# Altium schematic sheet Fastino_References.SchDoc: Fastino
size 420 x 297 mm; Author: G.Kasprowicz; CompanyName: WUT ISE; DrawnBy: G.Kasprowicz; Organization: WUT ISE; Address1: PW ISE; Address2: Nowowiejska 15/19 00-665 Warsaw; Address3: gkasprow@gmail.com; DocumentNumber: 9; Revision: 2; SheetNumber: 10; SheetTotal: 11; ModifiedBy: -; CheckedDate: -; Title2: DAC references; DivGrp: WUT ISE; Designer: G.Kasprowicz; ModifiedDate: -; ProjectName: Sensor Box
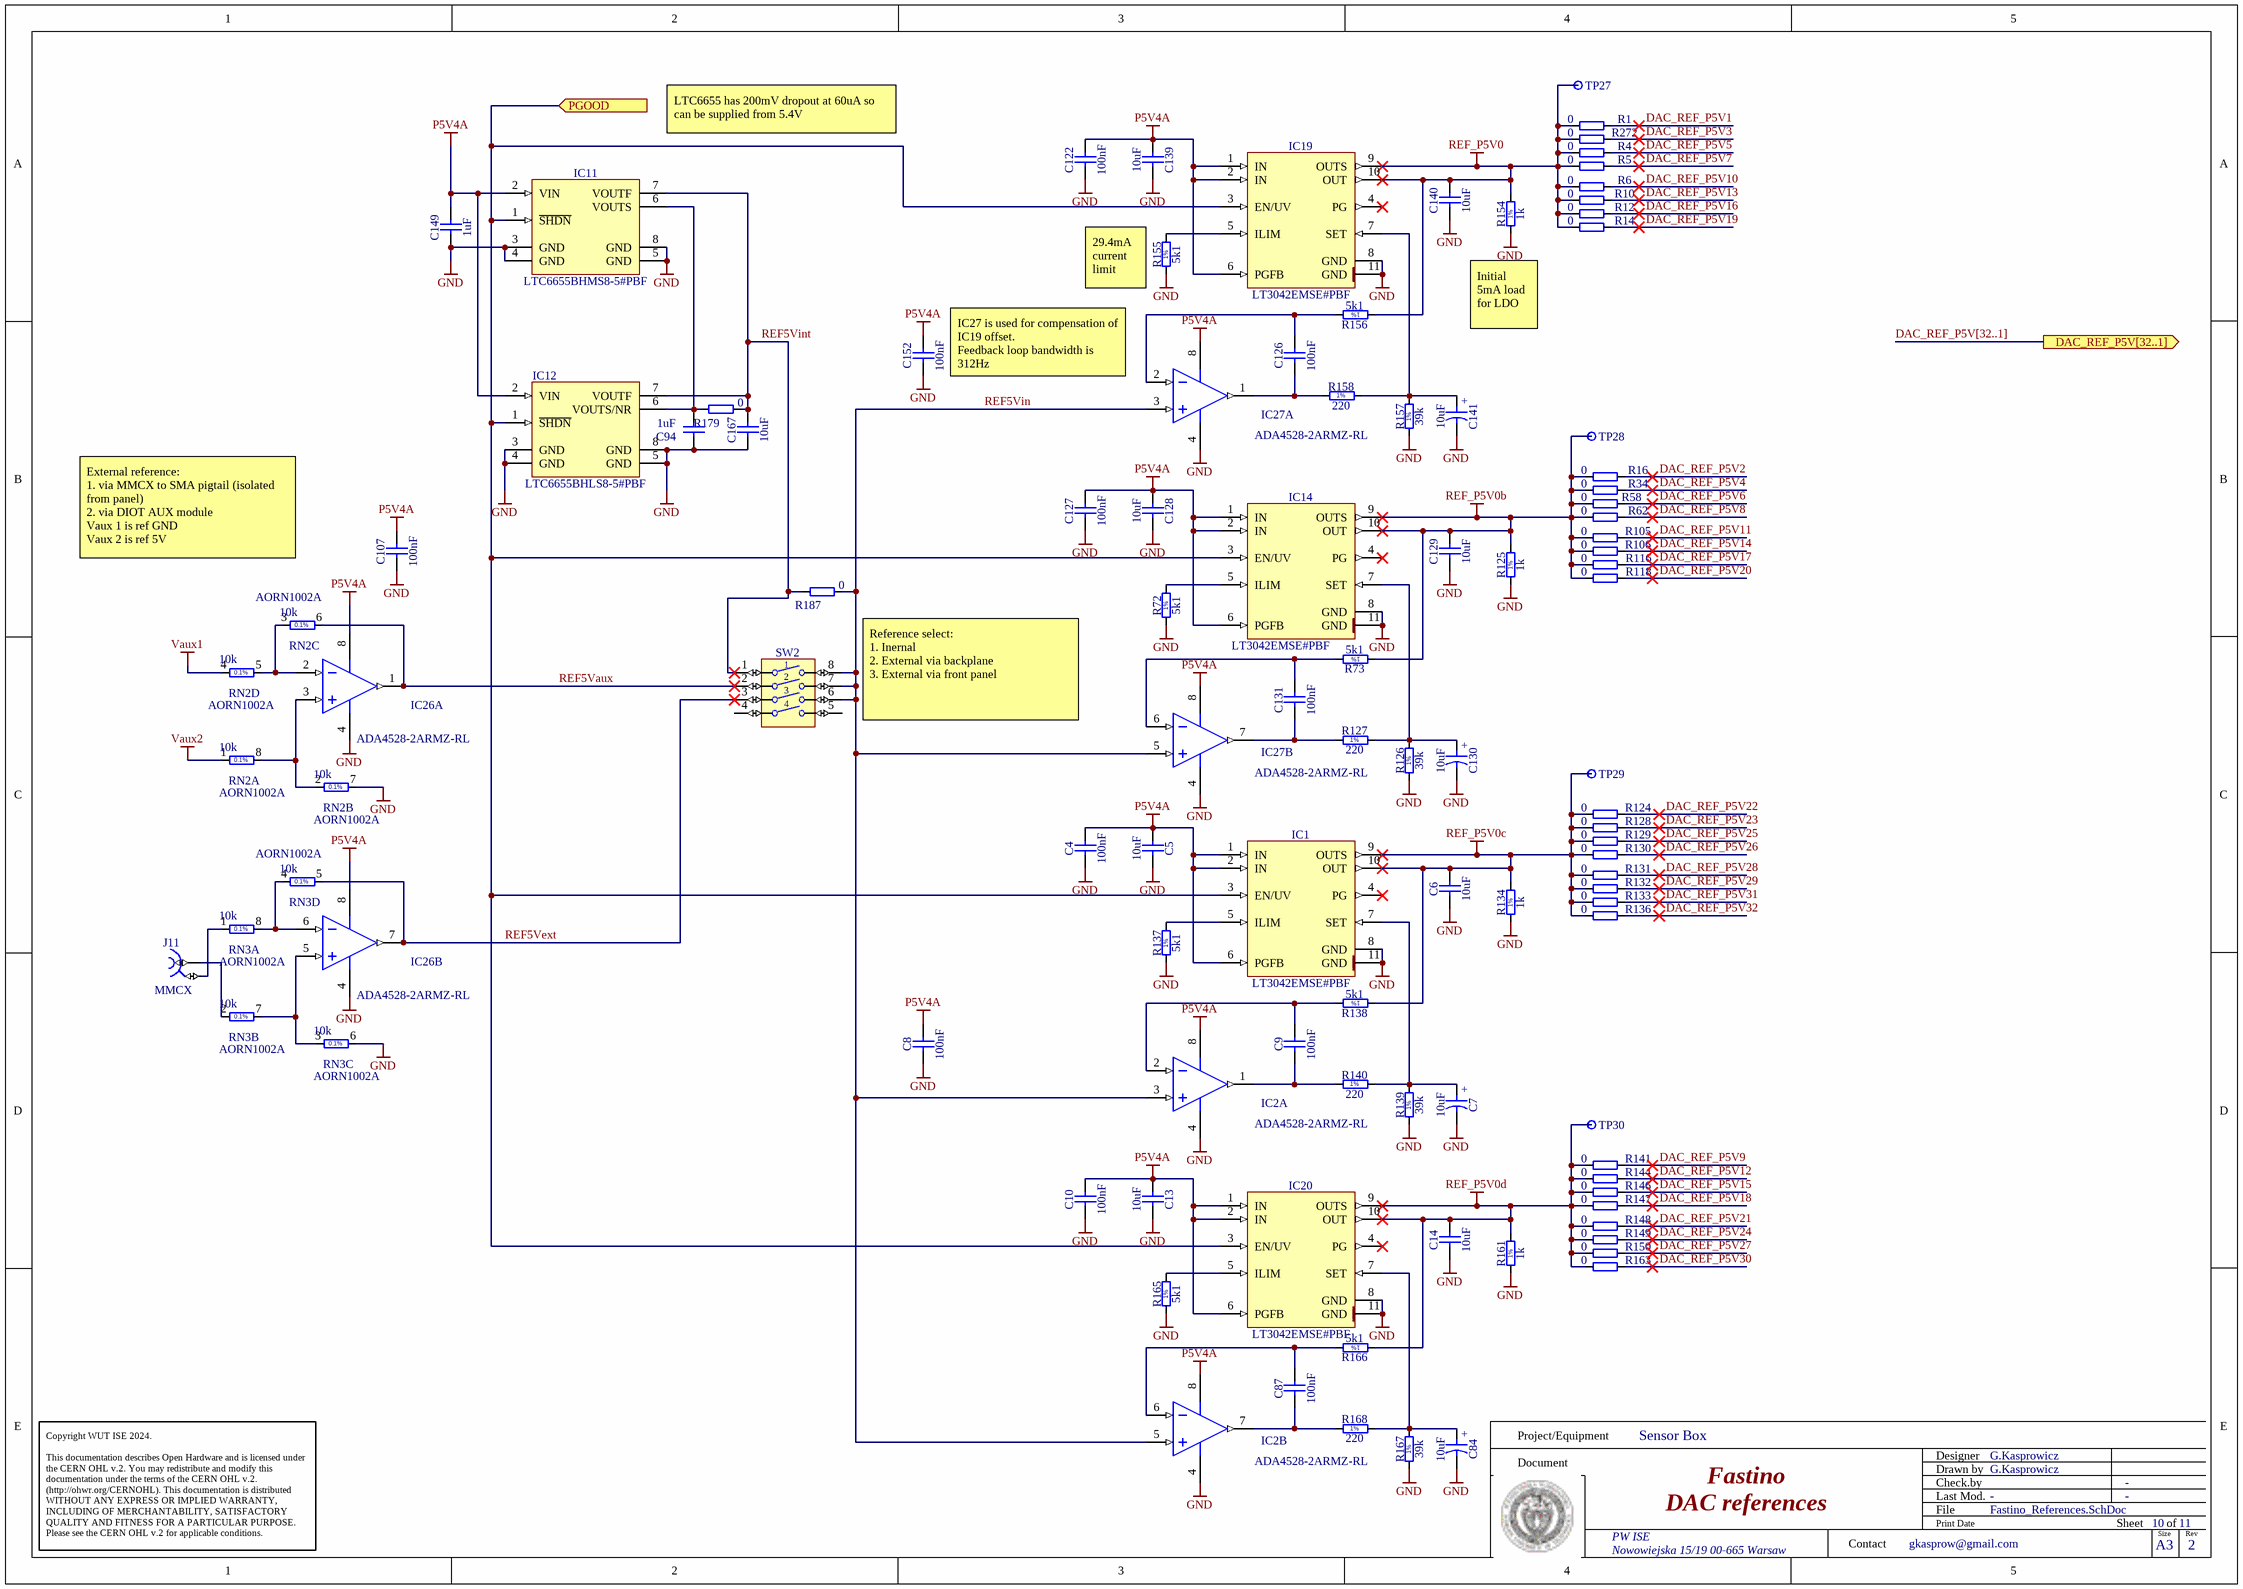
[diagram p0: Fastino_References.SchDoc]

## Parts
C4  100nF  [CAPC1005X55N]
C5  10uF  [CAPC1608X80N]
C6  10uF  [CAPC1608X80N]
C7  10uF  [CAPMP3216X180N]
C8  100nF  [CAPC1005X55N]
C9  100nF  [CAPC1005X55N]
C10  100nF  [CAPC1005X55N]
C13  10uF  [CAPC1608X80N]
C14  10uF  [CAPC1608X80N]
C84  10uF  [CAPMP3216X180N]
C87  100nF  [CAPC1005X55N]
C94  1uF  [CAPC1608X87N]
C107  100nF  [CAPC1005X55N]
C122  100nF  [CAPC1005X55N]
C126  100nF  [CAPC1005X55N]
C127  100nF  [CAPC1005X55N]
C128  10uF  [CAPC1608X80N]
C129  10uF  [CAPC1608X80N]
C130  10uF  [CAPMP3216X180N]
C131  100nF  [CAPC1005X55N]
C139  10uF  [CAPC1608X80N]
C140  10uF  [CAPC1608X80N]
C141  10uF  [CAPMP3216X180N]
C149  1uF  [CAPC1608X87N]
C152  100nF  [CAPC1005X55N]
C167  10uF  [CAPC1608X80N]
IC1  LT3042EMSE#PBF  [SOP50P490X110-11N-R168X198]
IC2  ADA4528-2ARMZ-RL  [ADI-RM-8_N]  (parts A,B of 2)
IC11  LTC6655BHMS8-5#PBF  [SOP65P490X110-8N]
IC12  LTC6655BHLS8-5#PBF  [8-CLCC]
IC14  LT3042EMSE#PBF  [SOP50P490X110-11N-R168X198]
IC19  LT3042EMSE#PBF  [SOP50P490X110-11N-R168X198]
IC20  LT3042EMSE#PBF  [SOP50P490X110-11N-R168X198]
IC26  ADA4528-2ARMZ-RL  [ADI-RM-8_N]  (parts A,B of 2)
IC27  ADA4528-2ARMZ-RL  [ADI-RM-8_N]  (parts A,B of 2)
J11  MMCX  [SAMTEC_MMCX-J-P-H-ST-TH1]
R1  0  [RESC1005X40N]
R4  0  [RESC1005X40N]
R5  0  [RESC1005X40N]
R6  0  [RESC1005X40N]
R10  0  [RESC1005X40N]
R12  0  [RESC1005X40N]
R14  0  [RESC1005X40N]
R16  0  [RESC1005X40N]
R34  0  [RESC1005X40N]
R58  0  [RESC1005X40N]
R62  0  [RESC1005X40N]
R72  5k1  [RESC1005X40N]
R73  5k1  [RESC1005X40N]
R105  0  [RESC1005X40N]
R106  0  [RESC1005X40N]
R116  0  [RESC1005X40N]
R118  0  [RESC1005X40N]
R124  0  [RESC1005X40N]
R125  1k  [RESC1005X40N]
R126  39k  [RESC1608X55N]
R127  220  [RESC1005X40N]
R128  0  [RESC1005X40N]
R129  0  [RESC1005X40N]
R130  0  [RESC1005X40N]
R131  0  [RESC1005X40N]
R132  0  [RESC1005X40N]
R133  0  [RESC1005X40N]
R134  1k  [RESC1005X40N]
R136  0  [RESC1005X40N]
R137  5k1  [RESC1005X40N]
R138  5k1  [RESC1005X40N]
R139  39k  [RESC1608X55N]
R140  220  [RESC1005X40N]
R141  0  [RESC1005X40N]
R144  0  [RESC1005X40N]
R146  0  [RESC1005X40N]
R147  0  [RESC1005X40N]
R148  0  [RESC1005X40N]
R149  0  [RESC1005X40N]
R150  0  [RESC1005X40N]
R154  1k  [RESC1005X40N]
R155  5k1  [RESC1005X40N]
R156  5k1  [RESC1005X40N]
R157  39k  [RESC1608X55N]
R158  220  [RESC1005X40N]
R161  1k  [RESC1005X40N]
R163  0  [RESC1005X40N]
R165  5k1  [RESC1005X40N]
R166  5k1  [RESC1005X40N]
R167  39k  [RESC1608X55N]
R168  220  [RESC1005X40N]
R179  0  [RESC1005X40N]
R187  0  [RESC1005X40N]
R272  0  [RESC1005X40N]
RN2  Manufacturer Part Number: AORN1002A  [SOIC127P600X175-8N]  (hidden comment: 10k)  (parts A,B,C,D of 4)
RN3  Manufacturer Part Number: AORN1002A  [SOIC127P600X175-8N]  (hidden comment: 10k)  (parts A,B,C,D of 4)
SW2  Switch  [SW_TYCO_1571983-4]  (value not drawn)
TP27  Test Point  [TPS127]  (value not drawn)
TP28  Test Point  [TPS127]  (value not drawn)
TP29  Test Point  [TPS127]  (value not drawn)
TP30  Test Point  [TPS127]  (value not drawn)

## Ports
DAC_REF_P5V[32..1] (out), PGOOD (in)

## Nets
GND: C4.1 C5.2 C6.1 C7.2 C8.1 C10.1 C13.2 C14.1 C84.2 C94.1 C107.1 C122.1 C127.1 C128.2 C129.1 C130.2 C139.2 C140.1 C141.2 C149.1 C152.1 C167.1 IC1.8(GND) IC1.11(GND) IC2.4(-V) IC11.3(GND) IC11.4(GND) IC11.5(GND) IC11.8(GND) IC12.3(GND) IC12.4(GND) IC12.5(GND) IC12.8(GND) IC14.8(GND) IC14.11(GND) IC19.8(GND) IC19.11(GND) IC20.8(GND) IC20.11(GND) IC26.4(-V) IC27.4(-V) R72.1 R125.1 R126.1 R134.1 R137.1 R139.1 R154.1 R155.1 R157.1 R161.1 R165.1 R167.1 RN2.7 RN3.6
P5V4A: C4.2 C5.1 C8.2 C10.2 C13.1 C107.2 C122.2 C127.2 C128.1 C139.1 C149.2 C152.2 IC1.1(IN) IC1.2(IN) IC1.6(PGFB) IC2.8(+V) IC11.2(VIN) IC12.2(VIN) IC14.1(IN) IC14.2(IN) IC14.6(PGFB) IC19.1(IN) IC19.2(IN) IC19.6(PGFB) IC20.1(IN) IC20.2(IN) IC20.6(PGFB) IC26.8(+V) IC27.8(+V)
REF_P5V0: C140.2 IC19.9(OUTS) IC19.10(OUT) R1.1 R4.1 R5.1 R6.1 R10.1 R12.1 R14.1 R154.2 R156.1 R272.1 TP27.1
REF_P5V0b: C129.2 IC14.9(OUTS) IC14.10(OUT) R16.1 R34.1 R58.1 R62.1 R73.1 R105.1 R106.1 R116.1 R118.1 R125.2 TP28.1
REF_P5V0c: C6.2 IC1.9(OUTS) IC1.10(OUT) R124.1 R128.1 R129.1 R130.1 R131.1 R132.1 R133.1 R134.2 R136.1 R138.1 TP29.1
REF_P5V0d: C14.2 IC20.9(OUTS) IC20.10(OUT) R141.1 R144.1 R146.1 R147.1 R148.1 R149.1 R150.1 R161.2 R163.1 R166.1 TP30.1
Vaux1: RN2.4
Vaux2: RN2.1
DAC_REF_P5V1: R1.2
DAC_REF_P5V2: R16.2
DAC_REF_P5V3: R272.2
DAC_REF_P5V4: R34.2
DAC_REF_P5V5: R4.2
DAC_REF_P5V6: R58.2
DAC_REF_P5V7: R5.2
DAC_REF_P5V8: R62.2
DAC_REF_P5V9: R141.2
DAC_REF_P5V10: R6.2
DAC_REF_P5V11: R105.2
DAC_REF_P5V12: R144.2
DAC_REF_P5V13: R10.2
DAC_REF_P5V14: R106.2
DAC_REF_P5V15: R146.2
DAC_REF_P5V16: R12.2
DAC_REF_P5V17: R116.2
DAC_REF_P5V18: R147.2
DAC_REF_P5V19: R14.2
DAC_REF_P5V20: R118.2
DAC_REF_P5V21: R148.2
DAC_REF_P5V22: R124.2
DAC_REF_P5V23: R128.2
DAC_REF_P5V24: R149.2
DAC_REF_P5V25: R129.2
DAC_REF_P5V26: R130.2
DAC_REF_P5V27: R150.2
DAC_REF_P5V28: R131.2
DAC_REF_P5V29: R132.2
DAC_REF_P5V30: R163.2
DAC_REF_P5V31: R133.2
DAC_REF_P5V32: R136.2
PGOOD: IC1.3(EN/UV) IC11.1(~{SHDN}) IC12.1(~{SHDN}) IC14.3(EN/UV) IC19.3(EN/UV) IC20.3(EN/UV) ; port PGOOD
REF5Vaux: IC26.1(OUT_A) RN2.6 SW2.2
REF5Vext: IC26.7(OUT_B) RN3.5 SW2.3
REF5Vin: IC2.3(+IN_A) IC2.5(+IN_B) IC27.3(+IN_A) IC27.5(+IN_B) R187.2 SW2.6 SW2.7 SW2.8
REF5Vint: C167.2 IC11.7(VOUTF) IC12.7(VOUTF) R179.2 R187.1 SW2.1
NetC7_1: C7.1 IC1.7(SET) R139.2 R140.2
NetC9_1: C9.1 IC2.1(OUT_A) R140.1
NetC9_2: C9.2 IC2.2(-IN_A) R138.2
NetC84_1: C84.1 IC20.7(SET) R167.2 R168.2
NetC87_1: C87.1 IC2.7(OUT_B) R168.1
NetC87_2: C87.2 IC2.6(-IN_B) R166.2
NetC94_2: C94.2 IC11.6(VOUTS) IC12.6(VOUTS/NR) R179.1
NetC126_1: C126.1 IC27.1(OUT_A) R158.1
NetC126_2: C126.2 IC27.2(-IN_A) R156.2
NetC130_1: C130.1 IC14.7(SET) R126.2 R127.2
NetC131_1: C131.1 IC27.7(OUT_B) R127.1
NetC131_2: C131.2 IC27.6(-IN_B) R73.2
NetC141_1: C141.1 IC19.7(SET) R157.2 R158.2
NetIC1_5: IC1.5(ILIM) R137.2
NetIC14_5: IC14.5(ILIM) R72.2
NetIC19_5: IC19.5(ILIM) R155.2
NetIC20_5: IC20.5(ILIM) R165.2
NetIC26_2: IC26.2(-IN_A) RN2.3 RN2.5
NetIC26_3: IC26.3(+IN_A) RN2.2 RN2.8
NetIC26_5: IC26.5(+IN_B) RN3.3 RN3.7
NetIC26_6: IC26.6(-IN_B) RN3.4 RN3.8
NetJ11_1: J11.1 RN3.2
NetJ11_2: J11.2 RN3.1

Not connected (* = marked no-connect by the designer): IC1 4(PG)*; IC14 4(PG)*; IC19 4(PG)*; IC20 4(PG)*; SW2 4 5

## Buses and harness runs
bus DAC_REF_P5V[32..1] = port DAC_REF_P5V[32..1]

## Notes on the sheet
- LTC6655 has 200mV dropout at 60uA so can be supplied from 5.4V
- (near R155) 29.4mA current limit
- Initial 5mA load for LDO
- (near C152) IC27 is used for compensation of IC19 offset.
  Feedback loop bandwidth is 312Hz
- External reference:
  1. via MMCX to SMA pigtail (isolated from panel)
  2. via DIOT AUX module
  Vaux 1 is ref GND
  Vaux 2 is ref 5V
- Reference select:
  1. Inernal
  2. External via backplane
  3. External via front panel
- Project/Equipment
- Document
- Designer
- Drawn by
- Check.by
- Copyright WUT ISE 2024.
  This documentation describes Open Hardware and is licensed under the CERN OHL v.2. You may redistribute and modify this documentation under the terms of the CERN OHL v.2. (http://ohwr.org/CERNOHL). This documentation is distributed WITHOUT ANY EXPRESS OR IMPLIED WARRANTY, INCLUDING OF MERCHANTABILITY, SATISFACTORY QUALITY AND FITNESS FOR A PARTICULAR PURPOSE. Please see the CERN OHL v.2 for applicable conditions.
- Contact
- File
- Last Mod.
- Print Date
- Sheet
- Size
- A3
- of
- Rev
- (in symbol CTE3216-18_10UF_16V_20%_AVX_TCJ) +
- (in symbol R0402_1K_1%_0.0625W_100PPM) 1%
- (in symbol R0402_5k1_1%_0.0625W_100PPM) 1%
- (in symbol R0402_5K1_1%_0.0625W_100PPM) 1%
- (in symbol R0402_220R_1%_0.0625W_100PPM) 1%
- (in symbol R0603_39K_1%_0.1W_100PPM) 1%
- (in symbol RN_10K_VISHAY_AORN1002A, part A) 0.1%
- (in symbol RN_10K_VISHAY_AORN1002A, part B) 0.1%
- (in symbol RN_10K_VISHAY_AORN1002A, part C) 0.1%
- (in symbol RN_10K_VISHAY_AORN1002A, part D) 0.1%

## Library data of the parts
C4 C8-C10 C87 C107 C122 C126 C127 C131 C152 = CC0402_100NF_16V_10%_X5R: Non-polarised capacitor; Part Description: SMD Multilayer Chip Ceramic Capacitor; Manufacturer: GENERIC; Manufacturer1 Part Number: GRM155R61C104KA88D; Voltage: 16V; TC: X5R; Tolerance: ±10%; Part Number: CC0402_100NF_16V_10%_X5R; Component Kind: Standard; Component Type: Standard; Pin Count: 2; Value: 100nF; Status: None; Manufacturer Part Number: CC0402_100NF_16V_10%_X5R; Case: 0402; Mounted: Yes; Socket: No; SMD: Yes; Sense: No; Manufacturer1 Example: MURATA; Manufacturer1 ComponentHeight: 0.55mm; HelpURL: \\cern.ch\dfs\Applications\Altium\Datasheets\CC0402_X5R_MURATA_GRM.pdf; Author: CERN DEM JLC; CreateDate: 10.12.2013; LatestRevisionDate: 10.12.2013
C5 C13 C128 C139 = CC0603_10UF_10V_10%_X5R: Non-polarised capacitor; Part Description: SMD Multilayer Chip Ceramic Capacitor; Manufacturer: GENERIC; Manufacturer1 Part Number: GRM188R61A106KE69D; Voltage: 10V; Tolerance: ±10%; TC: X5R; Part Number: CC0603_10UF_10V_10%_X5R; Component Kind: Standard; Component Type: Standard; Pin Count: 2; Value: 10uF; Status: None; Manufacturer Part Number: CC0603_10UF_10V_10%_X5R; Case: 0603; Mounted: Yes; Socket: No; SMD: Yes; Sense: No; HelpURL: \\cern.ch\dfs\Applications\Altium\Datasheets\CC0603_MURATA_GRM188R61A106KE69D.pdf; Author: CERN DEM JLC; CreateDate: 31.01.2017; LatestRevisionDate: 31.01.2017; Manufacturer1 Example: MURATA; Manufacturer1 ComponentHeight: 0.8mm
C6 C14 C129 C140 C167 = CC0603_10UF_10V_10%_X5R: Non-polarised capacitor; Part Description: SMD Multilayer Chip Ceramic Capacitor; Manufacturer: GENERIC; Manufacturer1 Part Number: GRM188R61A106KE69D; Voltage: 10V; TC: X5R; Tolerance: ±10%; Part Number: CC0603_10UF_10V_10%_X5R; Component Kind: Standard; Component Type: Standard; Pin Count: 2; Value: 10uF; Status: None; Manufacturer Part Number: CC0603_10UF_10V_10%_X5R; Case: 0603; Mounted: Yes; Socket: No; SMD: Yes; Sense: No; Manufacturer1 Example: MURATA; Manufacturer1 ComponentHeight: 0.8mm; HelpURL: \\cern.ch\dfs\Applications\Altium\Datasheets\CC0603_MURATA_GRM188R61A106KE69D.pdf; Author: CERN DEM JLC; CreateDate: 31.01.2017; LatestRevisionDate: 31.01.2017
C7 C84 C130 C141 = CTE3216-18_10UF_16V_20%_AVX_TCJ: Polarised capacitor; Part Description: ESR 0R200 Tantalum Solid Electrolytic Chip Capacitor with Conductive Polymer Electrode; Manufacturer: AVX; Manufacturer Part Number: TCJA106M016R0200 or  or TR3A106K016C1700; Voltage: 16V; Tolerance: ±20%; Part Number: CTE3216-18_10UF_16V_20%_AVX_TCJ; Component Kind: Standard; Component Type: Standard; Pin Count: 2; Value: 10uF; Status: Preferred; Case: A; Mounted: Yes; Socket: No; SMD: Yes; Sense: No; ComponentHeight: 1.8mm; HelpURL: \\cern.ch\dfs\Applications\Altium\Datasheets\CTE_AVX_TCJ.pdf; Author: CERN DEM JLC; CreateDate: 29.03.2012; LatestRevisionDate: 29.03.2012
C94 C149 = CC0603_1UF_25V_10%_X7R: Non-polarised capacitor; Part Description: SMD Multilayer Chip Ceramic Capacitor; Manufacturer: GENERIC; Manufacturer1 Part Number: GRM188R71E105KA12D; Voltage: 25V; TC: X7R; Tolerance: ±10%; Part Number: CC0603_1UF_25V_10%_X7R; Component Kind: Standard; Component Type: Standard; Pin Count: 2; Value: 1uF; Status: None; Manufacturer Part Number: CC0603_1UF_25V_10%_X7R; Case: 0603; Mounted: Yes; Socket: No; SMD: Yes; Sense: No; Manufacturer1 Example: MURATA; Manufacturer1 ComponentHeight: 0.9mm; HelpURL: \\cern.ch\dfs\Applications\Altium\Datasheets\CC0603_X7R_MURATA.pdf; Author: CERN DEM JLC; CreateDate: 18.01.2011; LatestRevisionDate: 18.01.2011
IC1 IC14 IC19 IC20 = LT3042EMSE#PBF: 20V, 200mA, Ultralow Noise, Ultrahigh PSRR RF Linear Regulator; Manufacturer: LINEAR TECHNOLOGY; PressFit: No; Bonding: No; Part Number: LT3042EMSE#PBF; Component Kind: Standard; Component Type: Standard; Device: LT3042EMSE#PBF; PackageDescription: SOP, 0.50mm, Pitch; 10 pin, 3.00mm W X 3.00mm L X 1.10mm H body (w/thermal tab  1.68 X 1.98 mm), IPC Medium Density; Part Description: 20V, 200mA, Ultralow Noise, Ultrahigh PSRR RF Linear Regulator; Manufacturer Part Number: LT3042EMSE#PBF; Pin Count: 11; Case: MSOP10; Mounted: Yes; Socket: No; SMD: Yes; Sense: No; ComponentHeight: 1.1mm; HelpURL: \\cern.ch\dfs\Applications\Altium\Datasheets\LT3042EMSE#PBF.pdf; Author: CERN DEM MR; CreateDate: 09.06.2016; LatestRevisionDate: 09.06.2016
IC2 IC26 IC27 = CMP-0384-01794-1: Double Channel RRIO Operational Amplifier, 3.4 MHz BW, 500 mV/us SR, Industrial, 8-pin SOP (RM-8), Reel; Manufacturer: Analog Devices; V Span Max: 5.5V; Iq/Amp: 1.5mA; Amplifiers Per Package: 2; Input Bias Current: 125pA; V Span Min: 2.2V; Small Signal Bandwidth: 3.4MHz; Input Offset Voltage: 300nV; Code_JEDEC: MO-187-AA; PackageReference: RM-8; ComponentLink3Description: Package Specification; Slew Rate: 500mV/us; PartNumber: ADA4528-2ARMZ-RL; ComponentLink2Description: Datasheet; Generic Part Number: ADA4528-2; DatasheetVersion: Rev. C; ComponentLink1URL: http://www.analog.com/en/index.html; Packing: Reel; ComponentLink3URL: http://www.analog.com/static/imported-files/packages/PKG_PDF/MSOP%28RM%29/RM_8.pdf; PackageDescription: 8-Pin Mini Small Outline Package, Body 3 x 3 mm, Pitch 0.65 mm; ComponentLink2URL: http://www.analog.com/static/imported-files/data_sheets/ADA4528-1_4528-2.pdf; ComponentLink1Description: Manufacturer URL; Mounting Technology: Surface Mount; Manufacturer Part Number: ADA4528-2ARMZ-RL
IC11 = LTC6655BHMS8-5#PBF: 0.25ppm Noise, Low Drift Precision Buffered Voltage Reference; Part Description: 5V, 0.25ppm Noise, Low Drift Precision Buffered Voltage Reference; Manufacturer: LINEAR TECHNOLOGY; PressFit: No; Bonding: No; Part Number: LTC6655BHMS8-5#PBF; Component Kind: Standard; Component Type: Standard; Device: LTC6655BHMS8-5#PBF; PackageDescription: SOP, 8-Leads, Body 3.1x3.1mm (max), Pitch 0.65mm, IPC Medium Density; Manufacturer Part Number: LTC6655BHMS8-5#PBF; Pin Count: 8; Case: SSOP8; Mounted: Yes; Socket: No; SMD: Yes; Sense: No; ComponentHeight: 1.1mm; HelpURL: \\cern.ch\dfs\Applications\Altium\Datasheets\LTC6655BHMS8-5#PBF.pdf; Author: CERN DEM JLC; CreateDate: 07.06.2012; LatestRevisionDate: 07.06.2012
IC12 = REF_LTC6655CHLS8-4.096: 5.0V, 1uA Precision Voltage Reference; Part Description: 5.0V, 0.05%, 10ppm/°C, 1uA Precision Voltage Reference; Manufacturer: LINEAR TECHNOLOGY; PressFit: No; Bonding: No; Part Number: LTC6655BHLS8-5#PBF; Component Kind: Standard; Component Type: Standard; Device: LTC6655BHLS8-5#PBF; Footprint: SOT95P280X100-6N; PackageDescription: LCC, 8-Pins, Body 5,00x5,00mmx1,45mm, Pitch 1,27mm, IPC Medium Density; Manufacturer Part Number: LTC6655BHLS8-5#PBF; Pin Count: 8; Case: 8-CLCC; Mounted: Yes; Socket: No; SMD: Yes; Sense: No; ComponentHeight: 1mm; HelpURL: \\cern.ch\dfs\Applications\Altium\Datasheets\LT6656ACS6-3.3#TRMPBF.pdf; Author: GK; CreateDate: 2011-10-10; LatestRevisionDate: 2011-10-10
J11 = SAMTEC_MMCX-J-P-H-ST-TH1: Part Description: Straight Through-hole 50 Ohms Micro Mini RF Jack, MMCX Series; Manufacturer: SAMTEC; PressFit: No; Part Number: SAMTEC_MMCX-J-P-H-ST-TH1; Component Kind: Standard; Component Type: Standard; Pin Count: 2; Mounted: Yes; Socket: No; SMD: No; Sense: No; Status: None; Manufacturer Part Number: MMCX-J-P-H-ST-TH1; ComponentHeight: 4.35mm; HelpURL: \\cern.ch\dfs\Applications\Altium\Datasheets\SAMTEC_MMCX-J-P-H-ST-TH1.pdf; Author: CERN DEM JLC; CreateDate: 05.12.2012; LatestRevisionDate: 05.12.2012
R1 R4-R6 R10 R12 R14 R16 R34 R58 R62 R105 R106 R116 R118 R124 R128-R133 R136 R141 R144 R146-R150 R163 R272 = R0402_0R_JUMPER: Resistor; Part Description: 1A (0.05R Max DC Resistance) Zero Ohm Jumper; Manufacturer: GENERIC; Manufacturer1 Part Number: 232270591001L; PressFit: No; Part Number: R0402_0R_JUMPER; Component Kind: Standard; Component Type: Standard; Pin Count: 2; Value: 0; Status: Not Recommended; Manufacturer Part Number: R0402_0R_JUMPER; Case: 0402; Mounted: Yes; Sense: No; Socket: No; SMD: Yes; Manufacturer1 Example: YAGEO PHYCOMP; Manufacturer1 ComponentHeight: 0.4mm; HelpURL: \\cern.ch\dfs\Applications\Altium\Datasheets\R0402_Phycomp_RC0402.pdf; Author: CERN DEM JLC; CreateDate: 03.12.2007; LatestRevisionDate: 17.10.2012
R72 R137 R155 R165 = R0402_5k1_1%_0.0625W_100PPM: Resistor - 1%; Part Description: General Purpose Thick Film Chip Resistor; Manufacturer: GENERIC; Manufacturer1 Part Number: 232270675102L; TC: ±100ppm/°C; PressFit: No; Part Number: R0402_5K1_1%_0.0625W_100PPM; Component Kind: Standard; Component Type: Standard; Pin Count: 2; Value: 5k1; Status: Not Recommended; Power: 0.0625W; Tolerance: ±1%; Manufacturer Part Number: R0402_5K1_1%_0.0625W_100PPM; Case: 0402; Mounted: Yes; Sense: No; Socket: No; SMD: Yes; Manufacturer1 Example: YAGEO PHYCOMP; Manufacturer1 ComponentHeight: 0.4mm; HelpURL: \\cern.ch\dfs\Applications\Altium\Datasheets\R0402_Phycomp_RC0402.pdf; Author: CERN DEM JLC; CreateDate: 03.12.2007; LatestRevisionDate: 17.10.2012
R73 R138 R156 R166 = R0402_5K1_1%_0.0625W_100PPM: Resistor - 1%; Part Description: General Purpose Thick Film Chip Resistor; Manufacturer: GENERIC; Manufacturer1 Part Number: 232270675102L; TC: ±100ppm/°C; PressFit: No; Part Number: R0402_5K1_1%_0.0625W_100PPM; Component Kind: Standard; Component Type: Standard; Pin Count: 2; Value: 5k1; Status: Not Recommended; Power: 0.0625W; Tolerance: ±1%; Manufacturer Part Number: R0402_5K1_1%_0.0625W_100PPM; Case: 0402; Mounted: Yes; Sense: No; Socket: No; SMD: Yes; Manufacturer1 Example: YAGEO PHYCOMP; Manufacturer1 ComponentHeight: 0.4mm; HelpURL: \\cern.ch\dfs\Applications\Altium\Datasheets\R0402_Phycomp_RC0402.pdf; Author: CERN DEM JLC; CreateDate: 03.12.2007; LatestRevisionDate: 17.10.2012
R125 R134 R154 R161 = R0402_1K_1%_0.0625W_100PPM: Resistor - 1%; Part Description: General Purpose Thick Film Chip Resistor; Manufacturer: GENERIC; Manufacturer1 Part Number: 232270671002L; TC: ±100ppm/°C; PressFit: No; Part Number: R0402_1K_1%_0.0625W_100PPM; Component Kind: Standard; Component Type: Standard; Pin Count: 2; Value: 1k; Status: Not Recommended; Power: 0.0625W; Tolerance: ±1%; Manufacturer Part Number: R0402_1K_1%_0.0625W_100PPM; Case: 0402; Mounted: Yes; Sense: No; Socket: No; SMD: Yes; Manufacturer1 Example: YAGEO PHYCOMP; Manufacturer1 ComponentHeight: 0.4mm; HelpURL: \\cern.ch\dfs\Applications\Altium\Datasheets\R0402_Phycomp_RC0402.pdf; Author: CERN DEM JLC; CreateDate: 03.12.2007; LatestRevisionDate: 17.10.2012
R126 R139 R157 R167 = R0603_39K_1%_0.1W_100PPM: Resistor - 1%; Part Description: General Purpose Thick Film Chip Resistor; Manufacturer: GENERIC; Manufacturer1 Part Number: NRC06F3902TRF; Power: 0.1W; TC: ±100ppm/°C; PressFit: No; Part Number: R0603_39K_1%_0.1W_100PPM; Component Kind: Standard; Component Type: Standard; Pin Count: 2; Value: 39k; Status: Preferred; Tolerance: ±1%; Manufacturer Part Number: R0603_39K_1%_0.1W_100PPM; Case: 0603; Mounted: Yes; Sense: No; Socket: No; SMD: Yes; Manufacturer1 Example: NIC COMPONENT; Manufacturer1 ComponentHeight: 0.55mm; HelpURL: \\cern.ch\dfs\Applications\Altium\Datasheets\R0603_NIC_NRC.pdf; Author: CERN DEM JLC; CreateDate: 03.12.2007; LatestRevisionDate: 13.03.2008
R127 R140 R158 R168 = R0402_220R_1%_0.0625W_100PPM: Resistor - 1%; Part Description: General Purpose Thick Film Chip Resistor; Manufacturer: GENERIC; Manufacturer1 Part Number: 232270672201L; TC: ±100ppm/°C; PressFit: No; Part Number: R0402_220R_1%_0.0625W_100PPM; Component Kind: Standard; Component Type: Standard; Pin Count: 2; Value: 220; Status: Not Recommended; Power: 0.0625W; Tolerance: ±1%; Manufacturer Part Number: R0402_220R_1%_0.0625W_100PPM; Case: 0402; Mounted: Yes; Sense: No; Socket: No; SMD: Yes; Manufacturer1 Example: YAGEO PHYCOMP; Manufacturer1 ComponentHeight: 0.4mm; HelpURL: \\cern.ch\dfs\Applications\Altium\Datasheets\R0402_Phycomp_RC0402.pdf; Author: CERN DEM JLC; CreateDate: 03.12.2007; LatestRevisionDate: 17.10.2012
R179 R187 = R0402_0R_JUMPER: Resistor; Part Description: 1A (0.05R Max DC Resistance) Zero Ohm Jumper; Manufacturer: GENERIC; Manufacturer1 Part Number: 232270591001L; Part Number: R0402_0R_JUMPER; Component Kind: Standard; Component Type: Standard; Pin Count: 2; Value: 0; Status: Not recommended; Manufacturer Part Number: R0402_0R_JUMPER; Case: 0402; Mounted: Yes; Sense: No; Socket: No; SMD: Yes; Manufacturer1 Example: YAGEO PHYCOMP; Manufacturer1 ComponentHeight: 0.4mm; HelpURL: \\cern.ch\dfs\Applications\Altium\Datasheets\R0402_Phycomp_RC0402.pdf; Author: CERN DEM JLC; CreateDate: 03.12.2007; LatestRevisionDate: 17.10.2012
RN2 RN3 = RN_10K_VISHAY_AORN1002A: DIL8 Resistor Network 4 Isolated Resistor 0.1%; Part Description: Dual-In-Line Thin Film Precision Automotive Resistors Network, (4 Isolated) - AORN Series; Manufacturer: VISHAY DALE; Power: 4x0.1W; TC: ±25ppm/°C; PressFit: No; Part Number: RN_10K_VISHAY_AORN1002A; Component Kind: Standard; Component Type: Standard; Pin Count: 8; Value: 10k; Sense: No; Tolerance: ±0.1%; Case: SOIC8; Mounted: Yes; Socket: No; SMD: Yes; ComponentHeight: 1.73mm; HelpURL: \\cern.ch\dfs\Applications\Altium\Datasheets\RN_VISHAY_AORN.pdf; Author: CERN DEM JLC; CreateDate: 20.02.2017; LatestRevisionDate: 03.05.2017
SW2 = SW_TYCO_1571983-4: 4 Ways SPST DIP Switch; Part Description: 4 Way SPST SMD DIP Switch, Latched, Contact Rating 0.025A 24VDC; Manufacturer: TYCO; Manufacturer Part Number: 1571983-4 or GDH04S04; PressFit: No; Part Number: SW_TYCO_1571983-4; Component Kind: Standard; Component Type: Standard; Pin Count: 8; PackageDescription: Pitch 1.27mm,  Body 6.2x6.2mm, 4 Ways SPST Surface-Mount DIP Switch, TYCO GDH Series; Family: Switch; Mounted: Yes; Socket: No; SMD: Yes; Sense: No; Status: None; ComponentHeight: 2.31mm; HelpURL: \\cern.ch\dfs\Applications\Altium\Datasheets\SW_TYCO_1571983-4.pdf; Author: CERN DEM JLC; CreateDate: 08/01/2009; LatestRevisionDate: 08/01/2009
TP27-TP30 = SMD_PAD_1.27X1.27MM: Part Description: 1.27mm x 1.27mm PCB Copper Area (SMD Test Point); Mounted: No; Part Number: SMD_PAD_1.27X1.27MM; Component Kind: Standard (No BOM); Component Type: Standard (No BOM); Pin Count: 1; Family: Test Point; Socket: No; SMD: No; Sense: No; Status: None; ComponentHeight: 0mm; HelpURL: Undefined; Author: CERN DEM JLC; CreateDate: 12.01.2008; LatestRevisionDate: 12.01.2008; PackageDescription: 1.27mm x 1.27mm PCB Copper Area (SMD Test Point)